# EAGLE design Regn Weather Station (EAGLE 9.0.1)
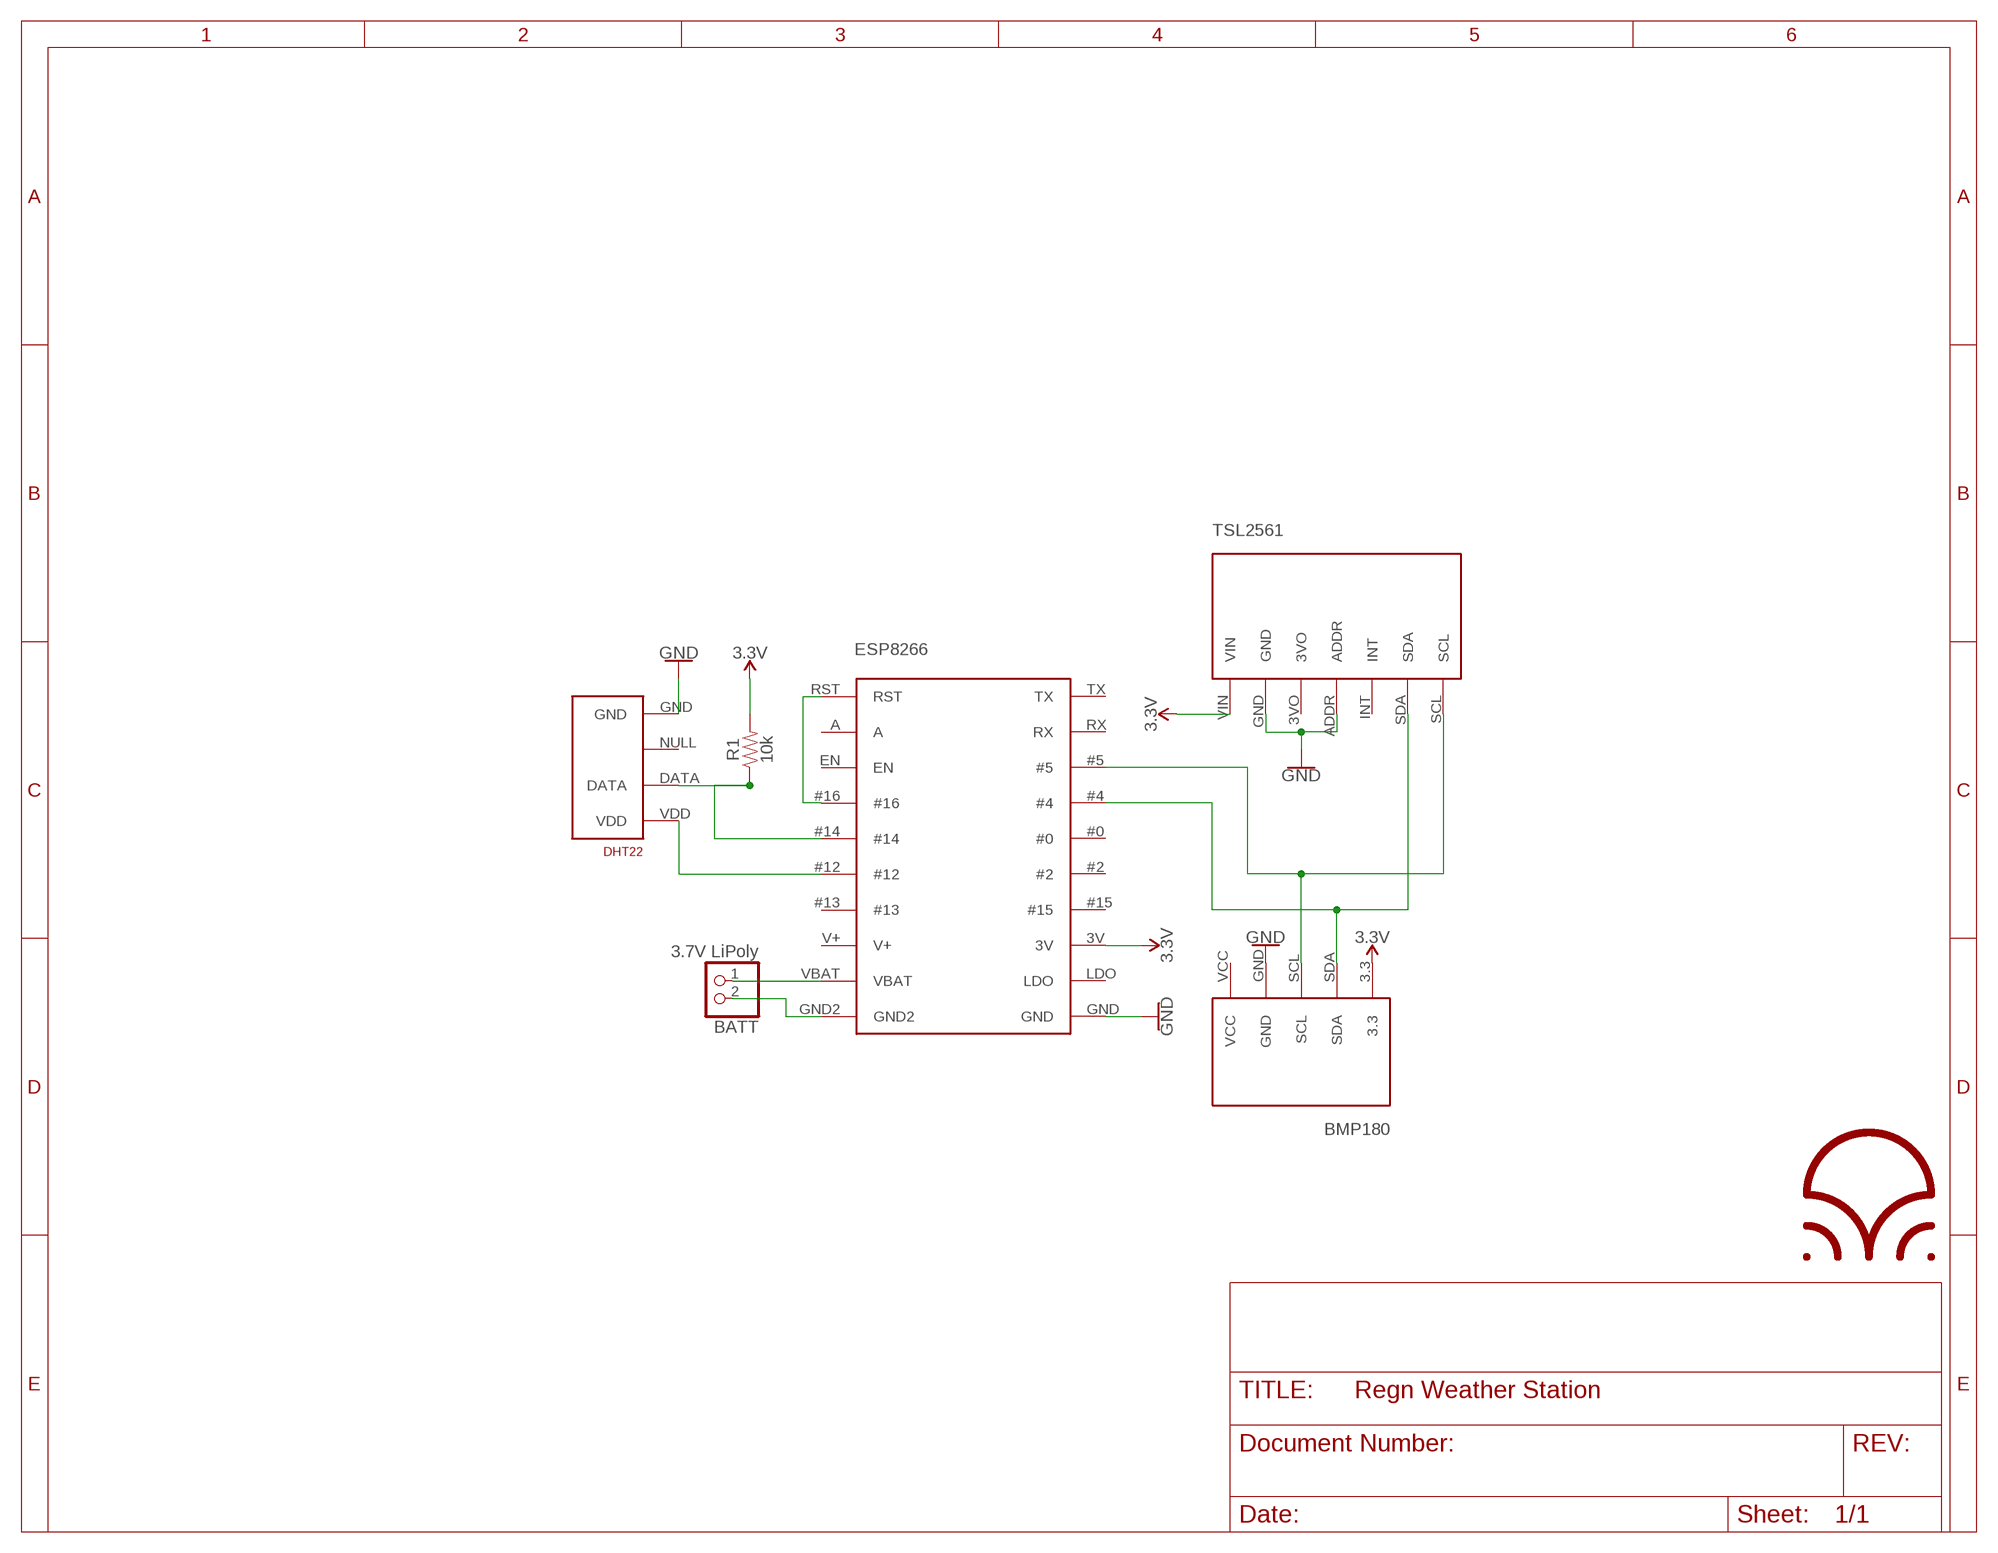
[diagram p0: schematic, sheet 1]

## Parts
BATT  3.7V LiPoly  JST_2PIN-SMT  [JST-PH-2-SMT]
BMP180  BMP180  [BMP180]
DHT22  RHT03_DHT-22_AM2302WIRED  [AM2302]
ESP8266  ESP8266HUZZAH  [ESP8266HUZZAH]
R1  10k  10KOHM-HORIZ-1/4W-1%  [AXIAL-0.3]
TSL2561  TSL2561  [TSL2561]

## Nets
3.3V: BMP180.3.3 ESP8266.3V R1.P$2 TSL2561.VIN
GND: BMP180.GND DHT22.GND ESP8266.GND TSL2561.ADDR TSL2561.GND
N$1: DHT22.DATA ESP8266.#14 R1.P$1
N$2: DHT22.VDD ESP8266.#12
N$3: BMP180.SDA ESP8266.#4 TSL2561.SDA
N$4: ESP8266.#16 ESP8266.RST
N$5: BMP180.SCL ESP8266.#5 TSL2561.SCL
N$6: BATT.1 ESP8266.VBAT
N$7: BATT.2 ESP8266.GND2
Unconnected: DHT22.NULL ESP8266.#0 ESP8266.#2 ESP8266.#13 ESP8266.#15 ESP8266.A ESP8266.EN ESP8266.LDO ESP8266.RX ESP8266.TX TSL2561.3VO TSL2561.INT

## Notes on the sheet
- /home/mika/images/regn.bmp

## Power pins joined to a net without a drawn wire
V+: ESP8266.V+
VCC: BMP180.VCC

## Library data of the parts
BATT = adafruit:JST_2PIN: JST 2-Pin Connectors of various flavors SMT-RA (S2B-PH-SM4) 4UConnector #17311 SMT (B2B-PH-SM4) THM-RA (S2B-PH) THM (B2B-PH)
BMP180 = regn:BMP180
DHT22 = RHT03_DHT-22_AM2302:RHT03_DHT-22_AM2302: RHT03 / DHT-22 / AM2302 Packages and symbol for the RHT03 / DHT-22 relative humidity and temperature sensor. Note: The AM2302 is a wired version of the DHT-22 which typically requires less clearance and is thus provided as a separate package.; PROD_ID: SEN-10167
ESP8266 = regn:ESP8266HUZZAH: Adafruit ESP8226 Huzzah 80 MHz microcontroller with WiFi front-end, with TCP/IP stack and DNS support. Contains onboard 500mA 3.3V regulator.
R1 = SparkFun-Resistors:10KOHM: 10kΩ resistor A resistor is a passive two-terminal electrical component that implements electrical resistance as a circuit element. Resistors act to reduce current flow, and, at the same time, act to lower voltage levels within circuits. - Wikipedia; PROD_ID: RES-12183
TSL2561 = regn:TSL2561

## Board
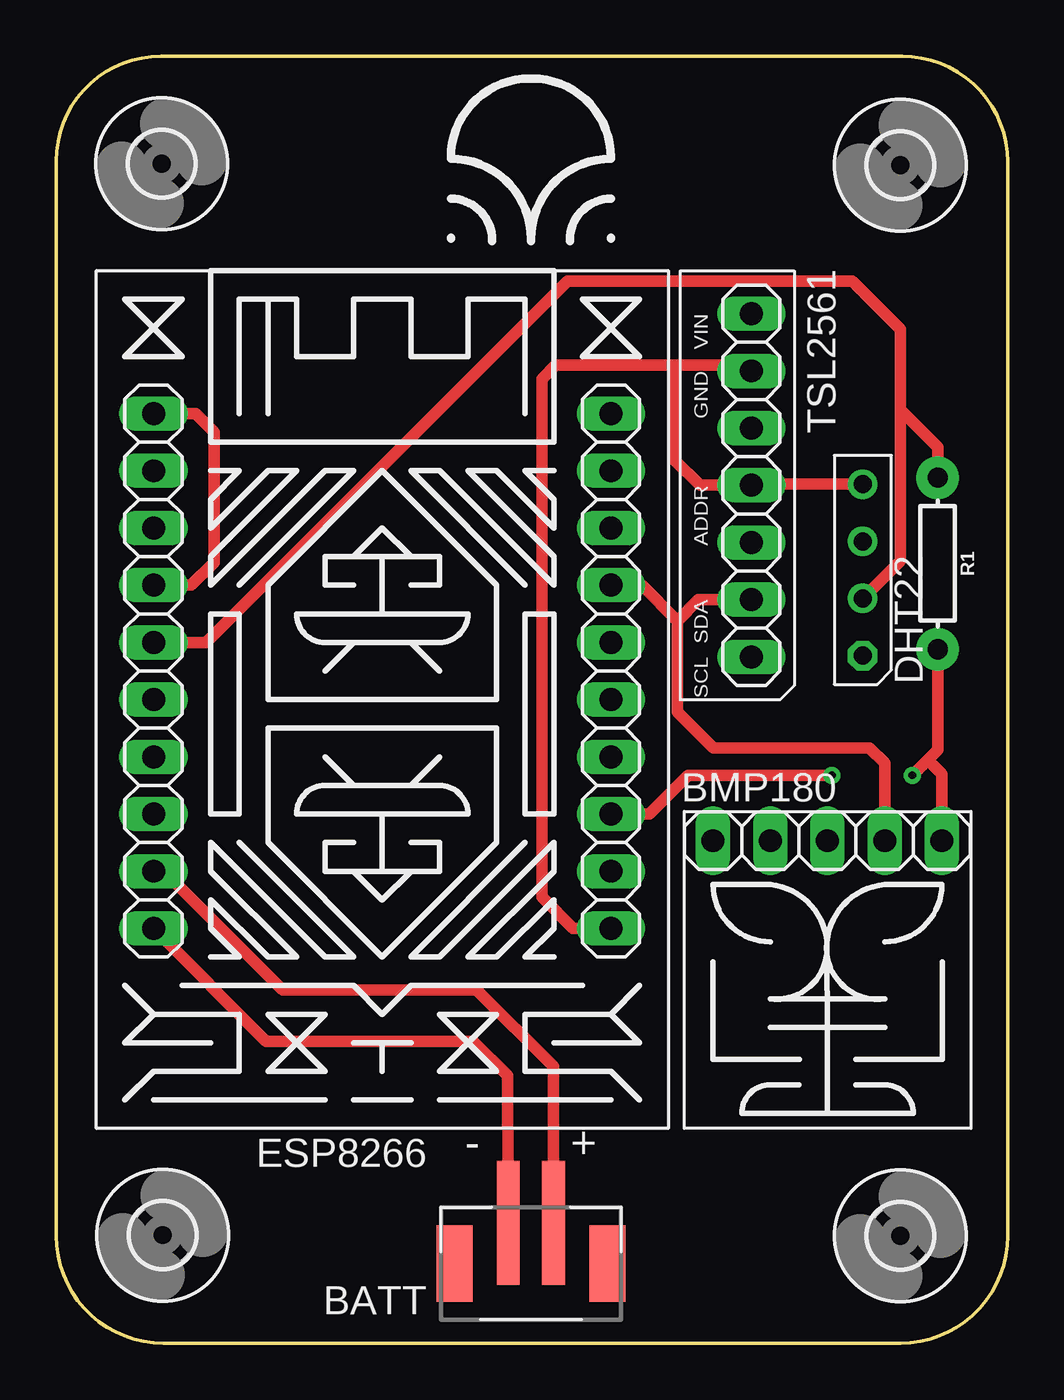
[diagram p1: board, top side]
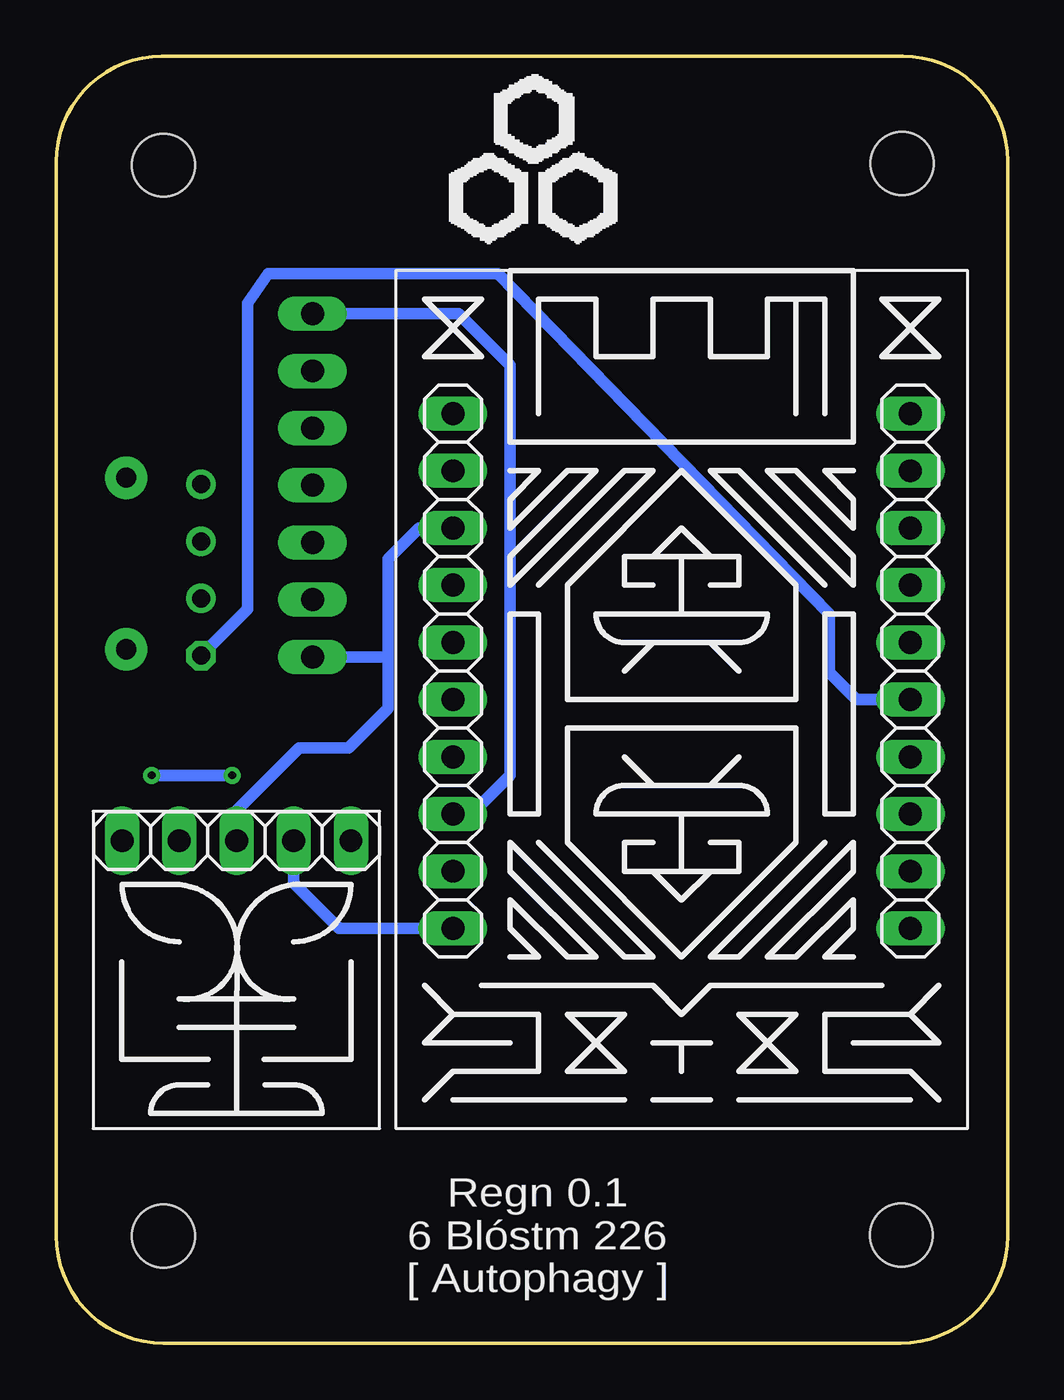
[diagram p2: board, bottom side, seen from below]

Size 42.25 x 57.15 mm. Coordinates in mm from the lower left corner, seen from the top.
Outline: 0,4.76 0,52.5 arc-90 4.65,57.15 37.57,57.15 arc-90 42.25,52.46 42.25,4.76 arc-90 37.49,0 4.76,0 arc-90 0,4.76
Copper layers (1*16): Top 0.035mm / dielectric 1.5mm / Bottom 0.035mm
Design rules "default": minimum track width 6mil, minimum drill 0.35mm, track to track 6mil, track to pad 6mil, pad to pad 6mil, via to via 6mil, smd to smd 6mil, copper to edge 40mil, drill to drill 6mil, minimum pad ring 10mil, minimum via ring 8mil, stop-mask expansion 4mil, vias tented up to drill 0mil, thermal gap 10mil

### Footprints (pad centres in the part's own frame; a part is rotated, then mirrored left to right if it is on the bottom)
JST-PH-2-SMT = smd 1 x 5.5: 1 -1,-1.8; 2 1,-1.8 | smd 1.6 x 3.4: NC1 -3.4,0; NC2 3.4,0
BMP180 = drill 1.016 long: 3.3 -11.511,1.377; GND -3.891,1.377; SCL -6.431,1.377; SDA -8.971,1.377; VCC -1.351,1.377
AM2302 = drill 0.8: DATA -1.27,0; GND 3.81,0; NULL 1.27,0 | drill 0.8 octagon: VDD -3.81,0
ESP8266HUZZAH = drill 1.016 long: 3V 20.32,-6.35; #0 20.32,1.27; #2 20.32,-1.27; #4 20.32,3.81; #5 20.32,6.35; #12 0,-1.27; #13 0,-3.81; #14 0,1.27; #15 20.32,-3.81; #16 0,3.81; A 0,8.89; EN 0,6.35; GND 20.32,-11.43; GND2 0,-11.43; LDO 20.32,-8.89; RST 0,11.43; RX 20.32,8.89; TX 20.32,11.43; V+ 0,-6.35; VBAT 0,-8.89
AXIAL-0.3 = drill 0.9 pad 1.88: P$1 -3.81,0; P$2 3.81,0
TSL2561 = drill 1.016 long: 3VO -2.54,0; ADDR 0,0; GND -5.08,0; INT 2.54,0; SCL 7.62,0; SDA 5.08,0; VIN -7.62,0
2,8 = hole 2.8: 0,0

### Placement (x,y rotation side)
BATT  21.08,3.54 180 top
BMP180  27.82,23.69 180 top
DHT22  35.82,34.34 90 top
ESP8266  4.32,29.85 0 top
R1  39.15,34.63 270 top
TSL2561  30.87,38.1 270 top
U$1  [2,8]  4.72,4.8 0 top
U$2  [2,8]  4.69,52.39 0 top
U$3  [2,8]  37.49,52.31 0 top
U$4  [2,8]  37.49,4.76 0 top

### Tracks (layer width: path | path; a pad name or v marks a point on that pad's centre or on a via)
3.3V  (via drill 0.35)
  Top 0.508: ESP8266.3V 26.33,23.5 28.05,25.22 v34.44,25.22 | v38.02,25.22 38.71,25.91 | 38.71,25.91 39.15,26.35 R1.P$2 | 38.71,25.91 39.33,25.29 BMP180.3.3
  Bottom 0.508: TSL2561.VIN 24.38,45.72 22.1,43.43 22.1,25.22 23.82,23.5 ESP8266.3V | v34.44,25.22 v38.02,25.22
GND
  Top 0.508: 24.57,18.49 ESP8266.GND 22.96,18.42 21.56,19.81 21.56,42.82 22.17,43.43 27.43,43.43 | TSL2561.GND 30.62,43.43 27.43,43.43 | 27.43,43.43 27.43,39.24 28.58,38.1 TSL2561.ADDR 30.92,38.15 DHT22.GND
  Bottom 0.254: ESP8266.GND 24.82,18.42
  Bottom 0.508: ESP8266.GND 29.7,18.42 31.71,20.43 BMP180.GND
N$1
  Top 0.508: ESP8266.#14 6.66,31.12 22.71,47.17 35.36,47.17 37.49,45.03 37.49,41.45 | DHT22.DATA 37.49,34.74 37.49,41.45 | R1.P$1 39.15,39.8 37.49,41.45
N$2
  Bottom 0.508: ESP8266.#12 6.71,28.58 7.92,29.79 7.92,32.39 22.63,47.5 32.84,47.5 33.76,46.18 33.76,32.59 DHT22.VDD
N$3
  Top 0.508: BMP180.SDA 36.79,25.77 36.12,26.44 29.18,26.44 27.58,28.04 27.58,32.08 | 27.58,32.08 26,33.66 ESP8266.#4 | TSL2561.SDA 28.52,33.02 27.58,32.08
N$4
  Top 0.508: ESP8266.#16 6,33.66 7.01,34.67 7.01,40.46 6.19,41.28 ESP8266.RST
N$5
  Bottom 0.508: 27.51,30.63 27.51,28.19 29.26,26.44 31.47,26.44 34.25,23.66 BMP180.SCL | 27.51,30.63 27.51,34.82 26.13,36.2 ESP8266.#5 | TSL2561.SCL 27.66,30.48 27.51,30.63
N$6
  Top 0.508: ESP8266.VBAT 4.79,20.96 10.06,15.7 18.67,15.7 22.08,12.28 BATT.1
N$7
  Top 0.508: 13.57,13.41 13.56,13.41 | 13.56,13.41 9.33,13.41 ESP8266.GND2 | BATT.2 20.04,10.93 20.04,11.88 18.52,13.41 13.56,13.41

### Text on the board
bPlace: Regn 0.1 / 6 Blóstm 226 / [ Autophagy ]